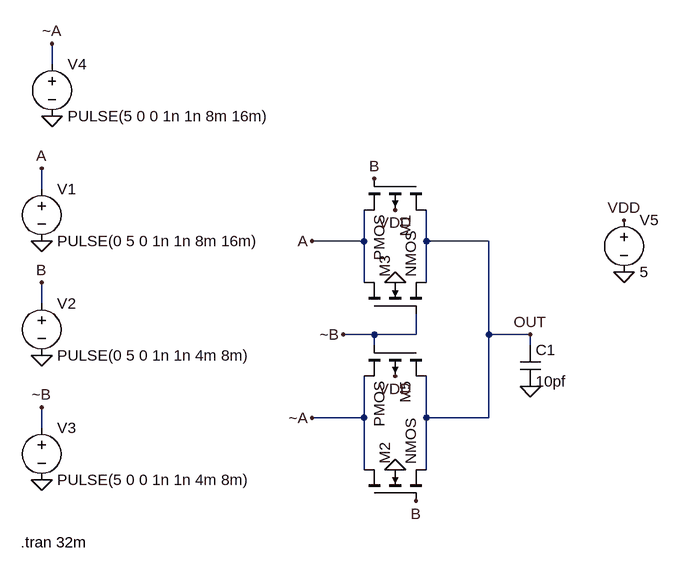
[diagram p0: schematic exp6 karan.asc]
exp6 karan.asc, the LTspice schematic file:
Version 4.1
SHEET 1 880 680
WIRE -368 -128 -368 -160
WIRE -384 64 -384 32
WIRE 112 144 112 96
WIRE 112 144 32 144
WIRE 208 144 208 96
WIRE 304 144 208 144
WIRE 112 208 112 144
WIRE 208 208 208 144
WIRE -384 240 -384 208
WIRE 128 288 80 288
WIRE 192 288 192 256
WIRE 192 288 128 288
WIRE 304 288 304 144
WIRE 368 288 304 288
WIRE 128 304 128 288
WIRE 368 304 368 288
WIRE 112 416 112 352
WIRE 112 416 32 416
WIRE 208 416 208 352
WIRE 304 416 304 288
WIRE 304 416 208 416
WIRE -384 432 -384 400
WIRE 112 496 112 416
WIRE 208 496 208 416
FLAG -384 320 0
FLAG -384 144 0
FLAG -384 512 0
FLAG 368 288 OUT
FLAG -368 -48 0
FLAG -384 32 A
FLAG -368 -160 ~A
FLAG -384 208 B
FLAG -384 400 ~B
FLAG 32 144 A
FLAG 80 288 ~B
FLAG 32 416 ~A
FLAG 192 544 B
FLAG 128 48 B
FLAG 160 208 0
FLAG 160 496 0
FLAG 160 96 VDD
FLAG 160 352 VDD
FLAG 512 112 VDD
FLAG 512 192 0
FLAG 368 368 0
SYMBOL voltage -384 48 R0
WINDOW 123 0 0 Left 0
WINDOW 39 0 0 Left 0
SYMATTR InstName V1
SYMATTR Value PULSE(0 5 0 1n 1n 8m 16m)
SYMBOL voltage -384 224 R0
WINDOW 123 0 0 Left 0
WINDOW 39 0 0 Left 0
SYMATTR InstName V2
SYMATTR Value PULSE(0 5 0 1n 1n 4m 8m)
SYMBOL voltage -384 416 R0
WINDOW 123 0 0 Left 0
WINDOW 39 0 0 Left 0
SYMATTR InstName V3
SYMATTR Value PULSE(5 0 0 1n 1n 4m 8m)
SYMBOL voltage -368 -144 R0
WINDOW 123 0 0 Left 0
WINDOW 39 0 0 Left 0
SYMATTR InstName V4
SYMATTR Value PULSE(5 0 0 1n 1n 8m 16m)
SYMBOL pmos4 208 48 R90
SYMATTR InstName M1
SYMBOL pmos4 208 304 R90
SYMATTR InstName M5
SYMBOL nmos4 112 544 R270
SYMATTR InstName M2
SYMBOL nmos4 112 256 R270
SYMATTR InstName M3
SYMBOL voltage 512 96 R0
WINDOW 123 0 0 Left 0
WINDOW 39 0 0 Left 0
SYMATTR InstName V5
SYMATTR Value 5
SYMBOL cap 352 304 R0
SYMATTR InstName C1
SYMATTR Value 10pf
TEXT -416 608 Left 2 !.tran 32m

The netlist it stands for:
* exp6 karan.asc
V1 A 0 PULSE(0 5 0 1n 1n 8m 16m)
V2 B 0 PULSE(0 5 0 1n 1n 4m 8m)
V3 ~B 0 PULSE(5 0 0 1n 1n 4m 8m)
V4 ~A 0 PULSE(5 0 0 1n 1n 8m 16m)
M1 OUT B A VDD PMOS
M5 OUT ~B ~A VDD PMOS
M2 ~A B OUT 0 NMOS
M3 A ~B OUT 0 NMOS
V5 VDD 0 5
C1 OUT 0 10pf
.model NMOS NMOS
.model PMOS PMOS
.lib standard.mos
.tran 32m
.backanno
.end